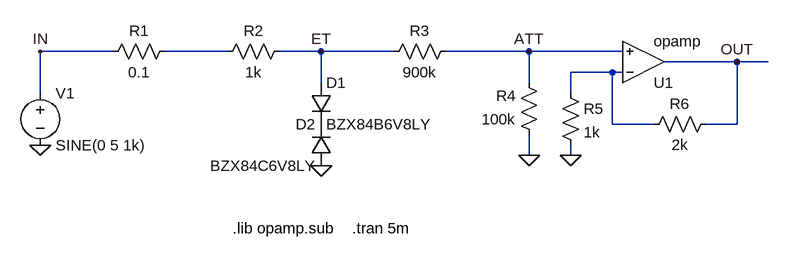
[diagram p0: schematic scope.asc]
scope.asc, the LTspice schematic file:
Version 4.1
SHEET 1 1328 680
WIRE 128 144 16 144
WIRE 304 144 208 144
WIRE 448 144 384 144
WIRE 560 144 448 144
WIRE 768 144 640 144
WIRE 912 144 768 144
WIRE 1088 160 976 160
WIRE 1136 160 1088 160
WIRE 896 176 832 176
WIRE 912 176 896 176
WIRE 448 192 448 144
WIRE 768 192 768 144
WIRE 16 208 16 144
WIRE 832 208 832 176
WIRE 896 256 896 176
WIRE 960 256 896 256
WIRE 1088 256 1088 160
WIRE 1088 256 1040 256
WIRE 768 304 768 272
WIRE 832 304 832 288
FLAG 16 288 0
FLAG 448 320 0
FLAG 16 144 IN
FLAG 768 304 0
FLAG 768 144 ATT
FLAG 832 304 0
FLAG 1088 160 OUT
FLAG 448 144 ET
SYMBOL voltage 16 192 R0
WINDOW 123 0 0 Left 0
WINDOW 39 0 0 Left 0
SYMATTR InstName V1
SYMATTR Value SINE(0 5 1k)
SYMBOL res 224 128 R90
WINDOW 0 0 56 VBottom 2
WINDOW 3 32 56 VTop 2
SYMATTR InstName R1
SYMATTR Value 0.1
SYMBOL res 400 128 R90
WINDOW 0 0 56 VBottom 2
WINDOW 3 32 56 VTop 2
SYMATTR InstName R2
SYMATTR Value 1k
SYMBOL diode 432 192 R0
SYMATTR InstName D1
SYMATTR Value BZX84B6V8LY
SYMBOL diode 464 320 R180
WINDOW 0 24 64 Left 2
WINDOW 3 24 0 Left 2
SYMATTR InstName D2
SYMATTR Value BZX84C6V8LY
SYMBOL res 656 128 R90
WINDOW 0 0 56 VBottom 2
WINDOW 3 32 56 VTop 2
SYMATTR InstName R3
SYMATTR Value 900k
SYMBOL res 784 288 R180
WINDOW 0 36 76 Left 2
WINDOW 3 36 40 Left 2
SYMATTR InstName R4
SYMATTR Value 100k
SYMBOL res 816 192 R0
SYMATTR InstName R5
SYMATTR Value 1k
SYMBOL res 1056 240 R90
WINDOW 0 0 56 VBottom 2
WINDOW 3 32 56 VTop 2
SYMATTR InstName R6
SYMATTR Value 2k
SYMBOL OpAmps\\opamp 944 224 M180
SYMATTR InstName U1
TEXT 496 416 Left 2 !.tran 5m
TEXT 312 416 Left 2 !.lib opamp.sub

The netlist it stands for:
* scope.asc
V1 IN 0 SINE(0 5 1k)
R1 N001 IN 0.1
R2 ET N001 1k
D1 ET P001 BZX84B6V8LY
D2 0 P001 BZX84C6V8LY
R3 ATT ET 900k
R4 0 ATT 100k
R5 N002 0 1k
R6 OUT N002 2k
X§U1 N002 ATT OUT opamp Aol=100K GBW=10Meg  ; pins invin noninvin out
.model D D
.lib standard.dio
.tran 5m
.lib opamp.sub
.backanno
.end